# EAGLE design penguat daya kelas a (EAGLE 9.6.2)
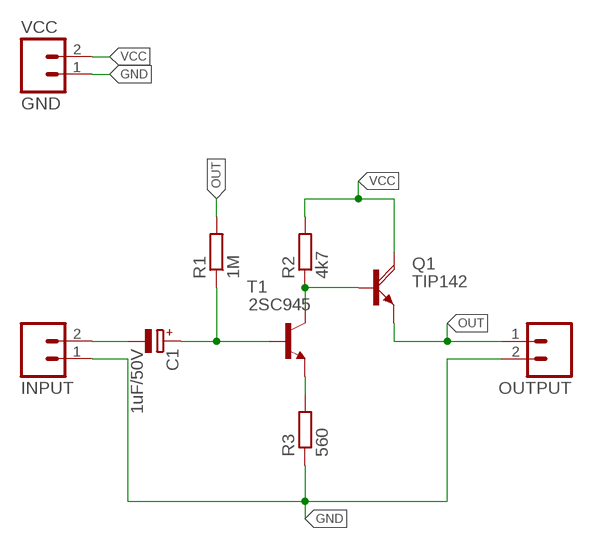
[diagram p0: schematic, sheet 1]

## Parts
C1  1uF/50V  CPOL-EUE3.5-8  [E3,5-8]
INPUT  INPUT  M02  [02P]
OUTPUT  OUTPUT  M02  [02P]
Q1  TIP142  [SOT93]
R1  1M  R-EU_0204/7  [0204/7]
R2  4k7  R-EU_0204/7  [0204/7]
R3  560  R-EU_0204/7  [0204/7]
T1  2SC945  [TO92-ECB]
VCC  GND  M02  [02P]

## Nets
GND: INPUT.1 OUTPUT.2 R3.1 VCC.1
N$1: C1.- INPUT.2
N$2: C1.+ R1.1 T1.B
N$3: Q1.B R2.1 T1.C
N$4: R3.2 T1.E
OUT: OUTPUT.1 Q1.E R1.2
VCC: Q1.C R2.2 VCC.2

## Library data of the parts
C1 = rcl:CPOL-EU: POLARIZED CAPACITOR, European symbol; SPICEPREFIX: C
INPUT OUTPUT VCC = con-amp-quick:M02: AMP QUICK CONNECTOR; OC_FARNELL: unknown; OC_NEWARK: unknown
Q1 = transistor-power:TIP142: NPN DARLINGTON TRANSISTOR
R1-R3 = rcl:R-EU_: RESISTOR, European symbol; SPICEPREFIX: R
T1 = transistor:2SC945: NPN Silicon Epitaxial Planar Transistor Source: SEMTECH ELECTRONICS LTD. ... 2SC945 2.pdf

## Board
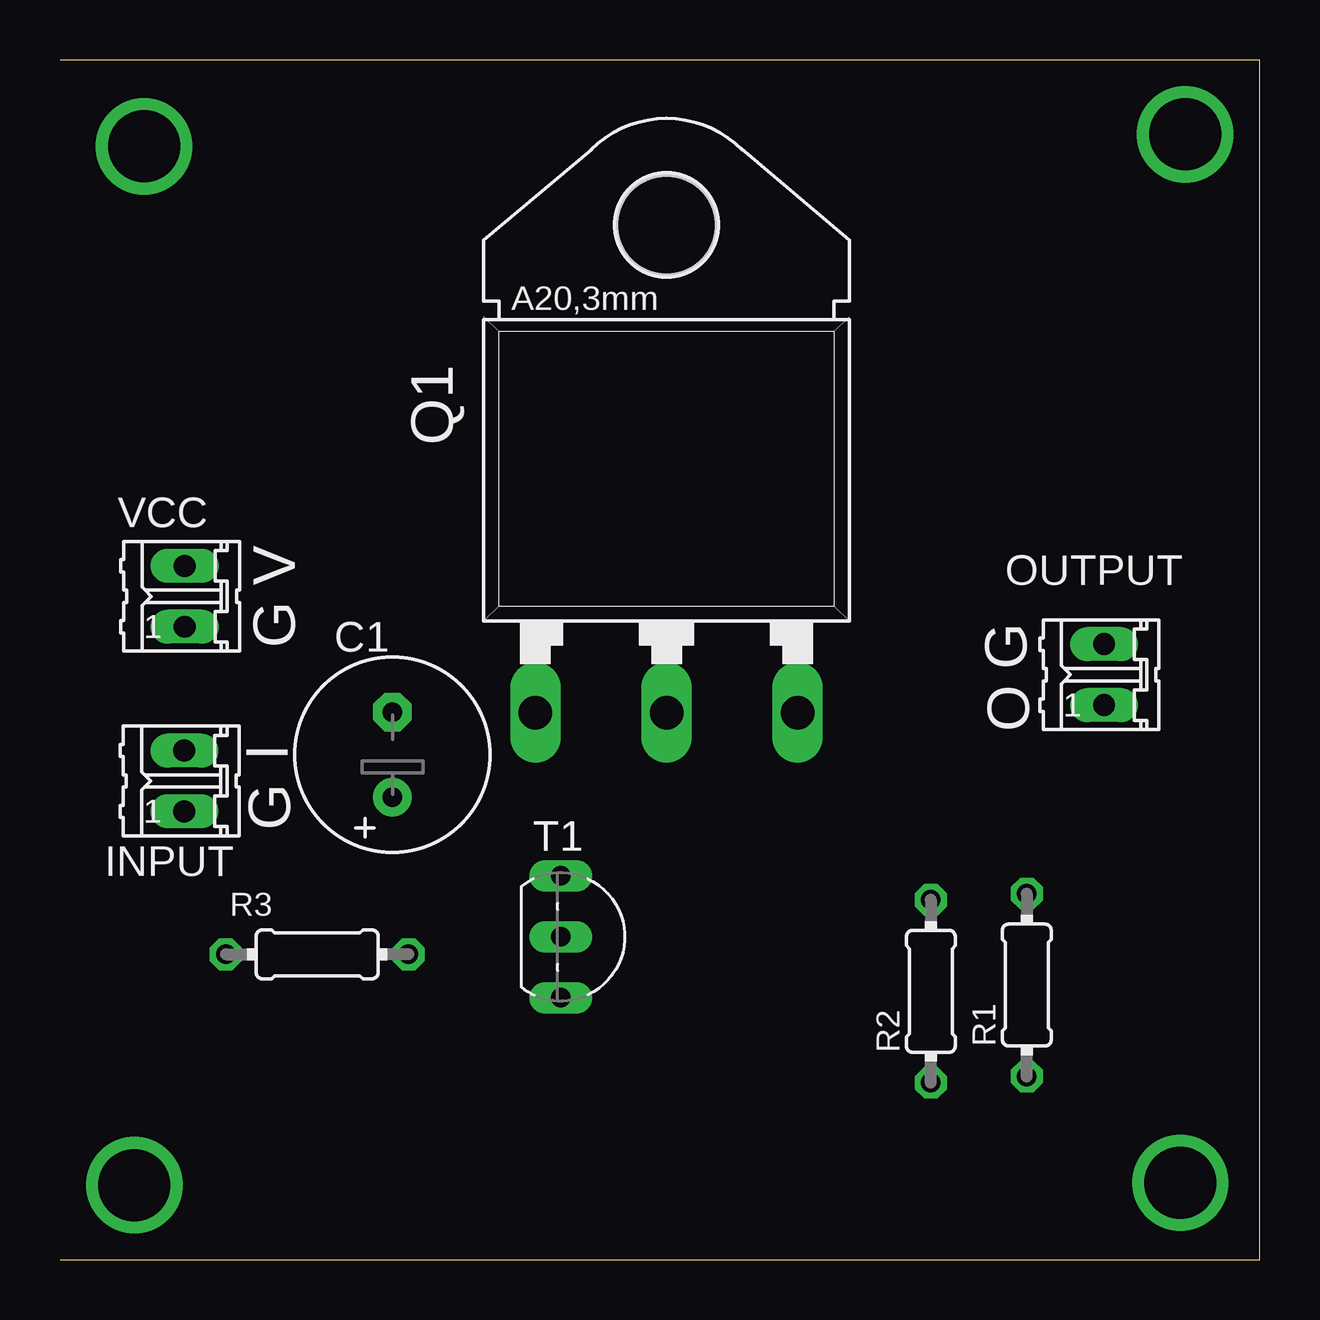
[diagram p1: board, top side]
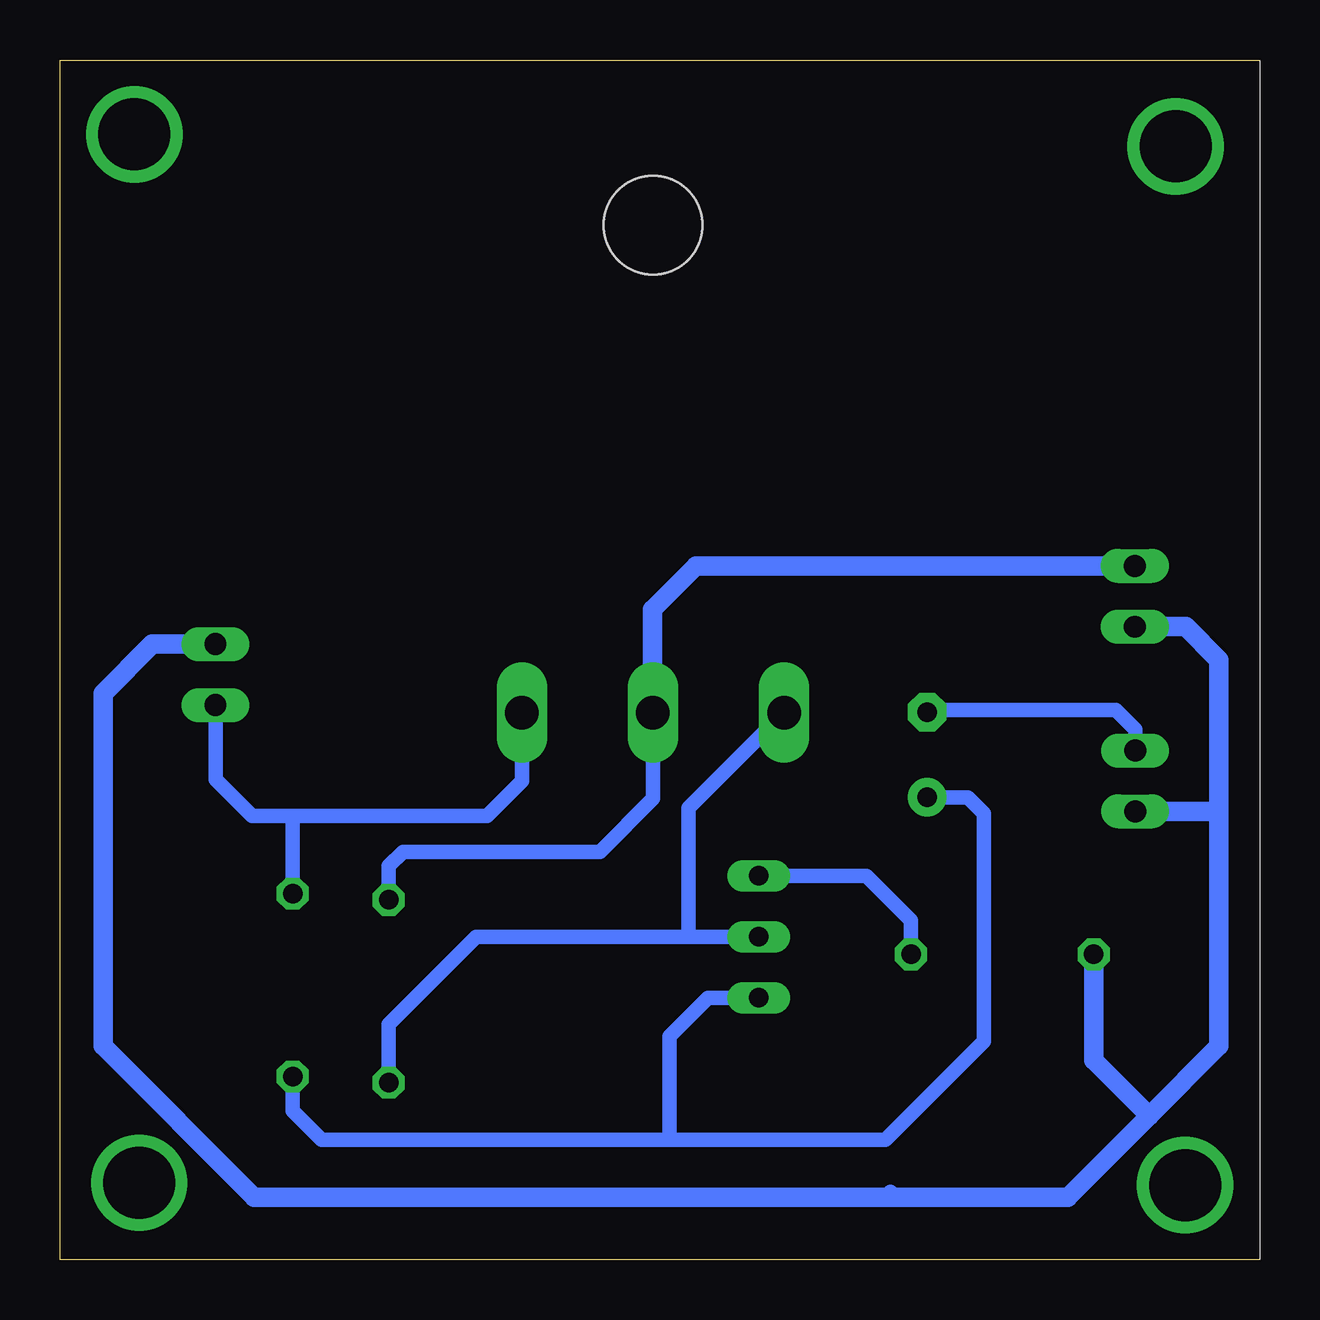
[diagram p2: board, bottom side, seen from below]

Size 50 x 50 mm. Coordinates in mm from the lower left corner, seen from the top.
Outline: 0,0 50,0 50,50 0,50
Copper layers (1*16): Top 0.035mm / dielectric 1.5mm / Bottom 0.035mm
Design rules "default *": minimum track width 6mil, minimum drill 0.35mm, track to track 12mil, track to pad 12mil, pad to pad 12mil, via to via 12mil, smd to smd 12mil, copper to edge 40mil, drill to drill 6mil, minimum pad ring 10mil, minimum via ring 8mil, stop-mask expansion 4mil, vias tented up to drill 0mil, thermal gap 10mil

### Footprints (pad centres in the part's own frame; a part is rotated, then mirrored left to right if it is on the bottom)
E3,5-8 = drill 0.813 pad 1.6: + -1.778,0 | drill 0.813 pad 1.6 octagon: - 1.778,0
02P = drill 0.914 long: 1 -1.27,0; 2 1.27,0
SOT93 = drill 1.397 long: B -5.461,-10.16; C 0,-10.16; E 5.461,-10.16 | hole 4.115: 0,10.16
0204/7 = drill 0.813 octagon: 1 -3.81,0; 2 3.81,0
TO92-ECB = drill 0.813 long: B 2.54,0; C 0,0; E -2.54,0

### Placement (x,y rotation side)
C1  13.86,21.04 90 top
INPUT  5.18,19.95 90 top
OUTPUT  43.52,24.38 90 top
Q1  25.28,32.96 0 top
R1  40.3,11.44 90 top
R2  36.3,11.18 90 top
R3  10.72,12.72 0 top
T1  20.87,13.45 270 top
VCC  5.2,27.65 90 top

### Tracks (layer width: path | path; a pad name or v marks a point on that pad's centre or on a via)
GND
  Bottom 0.61: 15.38,2.82 15.6,2.6
  Bottom 0.813: VCC.1 3.08,26.38 1.7,25 1.7,18.8 | 1.7,18.8 1.7,8.9 4.6,6 | 4.6,6 8,2.6 15.6,2.6 41.9,2.6 48.2,8.9 48.2,23.6 46.15,25.65 OUTPUT.2 | INPUT.1 1.82,18.68 1.7,18.8 | R3.1 6.91,8.31 4.6,6
N$1
  Bottom 0.61: INPUT.2 5.18,22.08 6,22.9 13.78,22.9 C1.-
N$2
  Bottom 0.61: R1.1 40.3,6.2 39.1,5 24.6,5 | T1.B 22.99,10.91 24.6,9.3 24.6,5 | C1.+ 12.16,19.26 11.5,18.6 11.5,9.1 15.6,5 24.6,5
N$3
  Bottom 0.61: T1.C 23.8,13.45 | 23.8,13.45 32.65,13.45 36.3,9.8 R2.1 | Q1.B 23.8,18.82 23.8,13.45
N$4
  Bottom 0.61: R3.2 14.53,14.13 16.39,15.99 T1.E
N$5  (via drill 3 pad 0.8)
  other vias: 3.5,46.4
N$6  (via drill 3 pad 0.8)
  other vias: 46.9,46.9
N$7  (via drill 3 pad 0.8)
  other vias: 46.7,3.2
N$8  (via drill 3 pad 0.8)
  other vias: 3.1,3.1
OUT
  Bottom 0.61: Q1.E 30.74,19.96 32.2,18.5 40.3,18.5 | 40.3,18.5 42,18.5 43.52,20.02 OUTPUT.1 | R1.2 40.3,18.5
VCC
  Bottom 0.61: Q1.C 25.28,19.22 27.5,17 35.7,17 36.3,16.4 R2.2
  Bottom 0.813: VCC.2 23.48,28.92 25.3,27.1 25.3,22.82 Q1.C

### Text on the board
tPlace: V | G | G | O | I | G